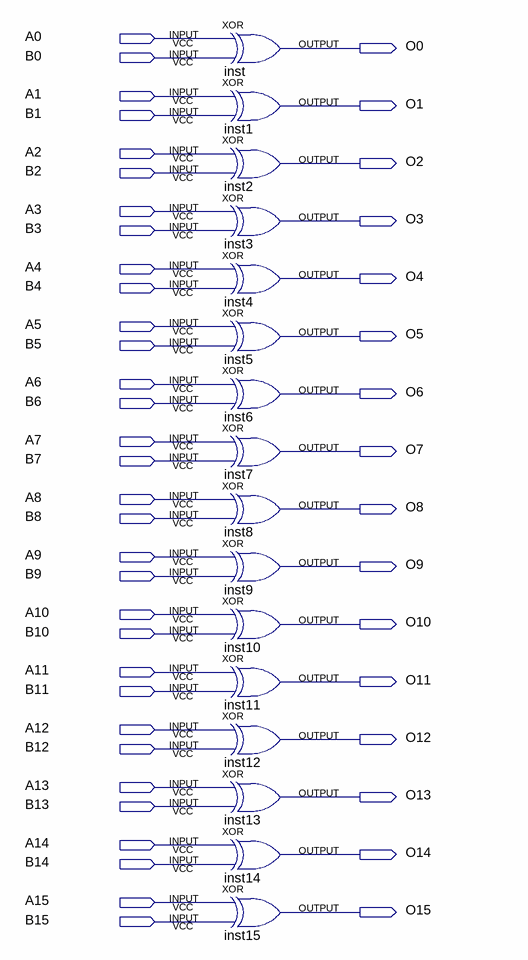
[diagram p0: schematic sheet]
// Quartus schematic Xor_16bit.bdf as structural Verilog: 16 symbols, 48 pins
module Xor_16bit (
  input  A0,
  input  B0,
  input  A1,
  input  B1,
  input  A2,
  input  B2,
  input  A3,
  input  B3,
  input  A4,
  input  B4,
  input  A5,
  input  B5,
  input  A6,
  input  B6,
  input  A7,
  input  B7,
  input  A8,
  input  B8,
  input  A9,
  input  B9,
  input  A10,
  input  B10,
  input  A11,
  input  B11,
  input  A12,
  input  B12,
  input  A13,
  input  B13,
  input  A14,
  input  B14,
  input  A15,
  input  B15,
  output O0,
  output O1,
  output O2,
  output O3,
  output O4,
  output O5,
  output O6,
  output O7,
  output O8,
  output O9,
  output O10,
  output O11,
  output O12,
  output O13,
  output O14,
  output O15
);

  xor inst (O0, A0, B0);
  xor inst1 (O1, A1, B1);
  xor inst2 (O2, A2, B2);
  xor inst3 (O3, A3, B3);
  xor inst4 (O4, A4, B4);
  xor inst5 (O5, A5, B5);
  xor inst6 (O6, A6, B6);
  xor inst7 (O7, A7, B7);
  xor inst8 (O8, A8, B8);
  xor inst9 (O9, A9, B9);
  xor inst10 (O10, A10, B10);
  xor inst11 (O11, A11, B11);
  xor inst12 (O12, A12, B12);
  xor inst13 (O13, A13, B13);
  xor inst14 (O14, A14, B14);
  xor inst15 (O15, A15, B15);
endmodule
